# Altium project bldc-robot-main-board-2016.PrjPcb
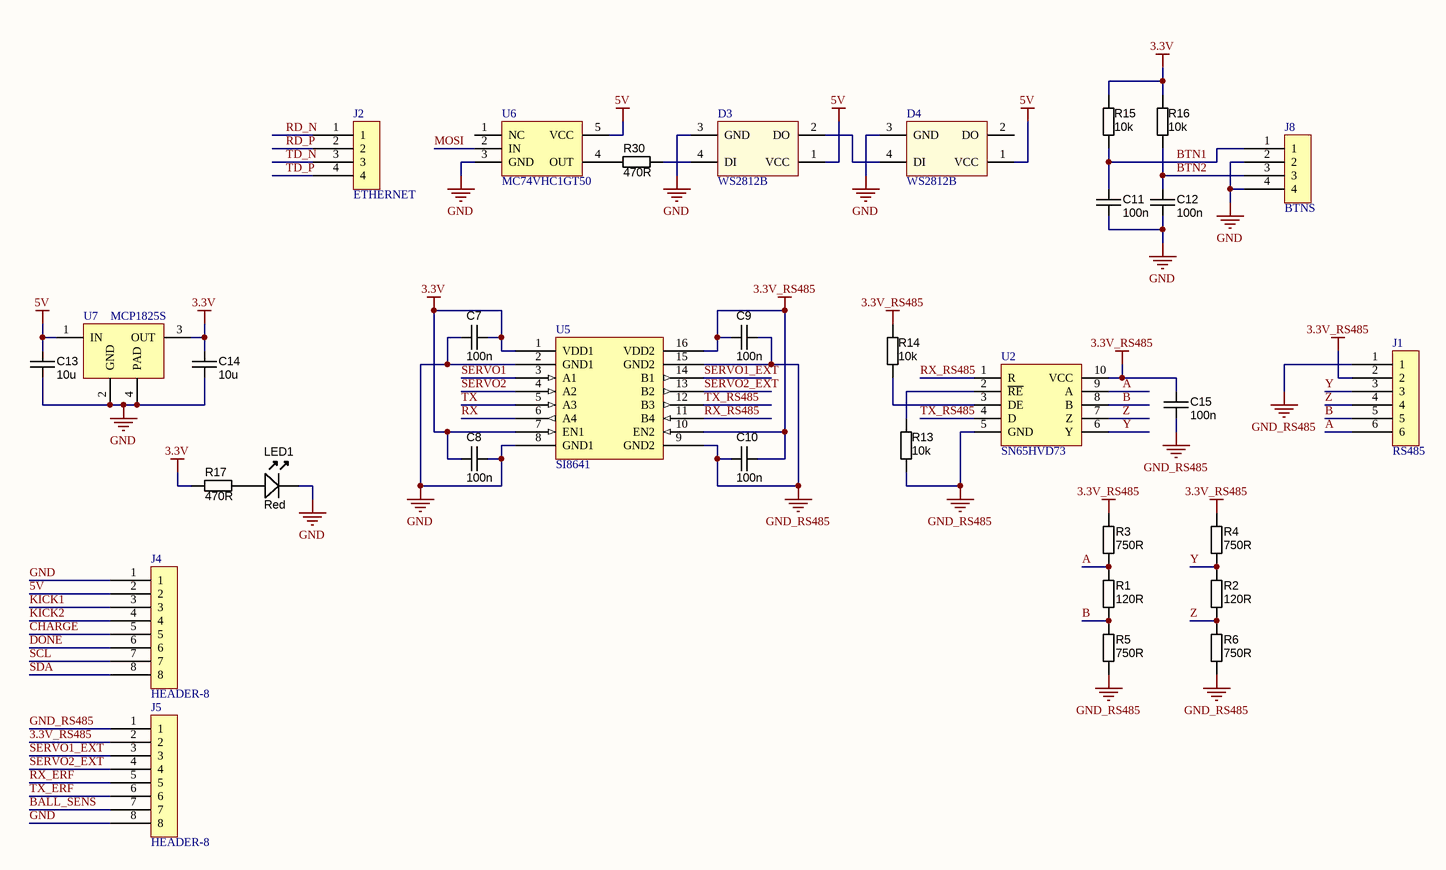
[diagram p0: bldc-robot-main-board-2016.SchDoc]
2 sheets, 72 parts. Net scope: global (net labels, ports and power ports of the same name join across sheets).
Board file: bldc-robot-main-board-2016.PcbDoc
Sheets:
  bldc-robot-main-board-2016.SchDoc
  bldc-robot-main-mbed.SchDoc

## Sheet bldc-robot-main-board-2016.SchDoc
size A3

### Parts
C7  100n  [CAPC1608X90N]
C8  100n  [CAPC1608X90N]
C9  100n  [CAPC1608X90N]
C10  100n  [CAPC1608X90N]
C11  100n  [CAPC1608X90N]
C12  100n  [CAPC1608X90N]
C13  10u  [CAPC3216X180N]
C14  10u  [CAPC3216X180N]
C15  100n  [CAPC1608X90N]
D3  WS2812B  [WS2812B]
D4  WS2812B  [WS2812B]
J1  RS485  [MICRO-MATCH-6]
J2  ETHERNET  [MICRO-MATCH-4]
J4  HEADER-8  [MICRO-MATCH-8]
J5  HEADER-8  [MICRO-MATCH-8]
J8  BTNS  [MICRO-MATCH-4]
LED1  Red  [LED-0603-RED]
R1  120R  [RESC1608X55N]
R2  120R  [RESC1608X55N]
R3  750R  [RESC1608X55N]
R4  750R  [RESC1608X55N]
R5  750R  [RESC1608X55N]
R6  750R  [RESC1608X55N]
R13  10k  [RESC1608X55N]
R14  10k  [RESC1608X55N]
R15  10k  [RESC1608X55N]
R16  10k  [RESC1608X55N]
R17  470R  [RESC1608X55N]
R30  470R  [RESC1608X55N]
U2  SN65HVD73  [SOP10]
U5  SI8641  [SOIC16]
U6  MC74VHC1GT50  [SC70-5]
U7  MCP1825S  [SOT230P700X180-4N]

### Nets
3.3V: C7.1 C8.2 C14.1 R15.2 R16.2 R17.2 U5.1(VDD1) U5.7(EN1) U7.3(OUT)
3.3V_RS485: C9.2 C10.1 C15.1 J1.2 J5.2 R3.1 R4.1 R14.2 U2.10(VCC) U5.10(EN2) U5.16(VDD2)
5V: C13.1 D3.1(VCC) D4.1(VCC) J4.2 U6.5(VCC) U7.1(IN)
GND: C7.2 C8.1 C11.2 C12.2 C13.2 C14.2 D3.3(GND) D4.3(GND) J4.1 J5.8 J8.2 J8.4 LED1.K U5.2(GND1) U5.8(GND1) U6.3(GND) U7.2(GND) U7.4(PAD)
GND_RS485: C9.1 C10.2 C15.2 J1.1 J5.1 R5.2 R6.2 R13.1 U2.5(GND) U5.9(GND2) U5.15(GND2)
A: J1.6 R1.1 R3.2 U2.9(A)
B: J1.5 R1.2 R5.1 U2.8(B)
BALL_SENS: J5.7
BTN1: C11.1 J8.1 R15.1
BTN2: C12.1 J8.3 R16.1
CHARGE: J4.5
DONE: J4.6
KICK1: J4.3
KICK2: J4.4
MOSI: U6.2(IN)
RD_N: J2.1
RD_P: J2.2
RX: U5.6(A4)
RX_ERF: J5.5
RX_RS485: U2.1(R) U5.11(B4)
SCL: J4.7
SDA: J4.8
SERVO1: U5.3(A1)
SERVO1_EXT: J5.3 U5.14(B1)
SERVO2: U5.4(A2)
SERVO2_EXT: J5.4 U5.13(B2)
TD_N: J2.3
TD_P: J2.4
TX: U5.5(A3)
TX_ERF: J5.6
TX_RS485: U2.4(D) U5.12(B3)
Y: J1.3 R2.1 R4.2 U2.6(Y)
Z: J1.4 R2.2 R6.1 U2.7(Z)
NetD3_2: D3.2(DO) D4.4(DI)
NetD3_4: D3.4(DI) R30.1
NetLED1_A: LED1.A R17.1
NetR13_2: R13.2 U2.2(~{RE})
NetR14_1: R14.1 U2.3(DE)
NetR30_2: R30.2 U6.4(OUT)

Not connected (* = marked no-connect by the designer): D4 2(DO); U6 1(NC)

### Library data of the parts
C7-C12 C15 = CAPC_100n_0603_X7R_50V_10%: Capacitor SMD Cer 100nF 10% 50V X7R 0603; Manufacturer 1: AVX Corporation; Manufacturer Part Number 1: 06035C104KAT2A; Ratings: 50V; X7R; Material: ceramic; SCDType: spec; Manufacturer 2: TDK Corporation; Manufacturer Part Number 2: C1608X7R1H104K; Package / Case: 0603 (1608 Metric); Tolerance: ±10%; Supplier 1: Digi-Key; Supplier Part Number 1: 478-5052-1-ND; ComponentLink1URL: http://www.avx.com/docs/Catalogs/cx7r.pdf; ComponentLink1Description: http://www.avx.com/docs/Catalogs/cx7r.pdf; Supplier 2: Digi-Key; Supplier Part Number 2: 445-1314-1-ND; ComponentLink2URL: http://product.tdk.com/capacitor/mlcc/en/documents/mlcc_commercial_general_en.pdf; ComponentLink2Description: http://product.tdk.com/capacitor/mlcc/en/documents/mlcc_commercial_general_en.pdf; Value: 100n
C13 C14 = CAPC_10u_1206_10V: Capacitor SMD Cer 10uF 10% 10V X5R 1206; Manufacturer 1: KEMET; Manufacturer Part Number 1: C1206C106K8PACTU; Ratings: 10V; X5R; Material: ceramic; Value: 10µ; SCDType: undef; Package / Case: 1206 (3216 metric); Tolerance: ±10%; Supplier 1: Digi-Key; Supplier Part Number 1: C1206C106K8PACTU-ND
J1 = HEADER-6
J2 J8 = HEADER-4
LED1 = LED_SMD_Red_0603_220mcd: LED 0603 SMD Hyper Red 630nm 220mcd 20mA; Manufacturer 1: Kingbright Company LLC; Manufacturer Part Number 1: APT1608SURCK; Material: AlGaInP on GaAs; Ratings: 220 mcd; 630 nm; Voltage - Forward (Vf) Typ: 1.95V; Voltage - Forward (Vf) @ 10mA: 1.9V; SCDType: source; Package / Case: 0603 (1608 metric); Supplier 1: Digi-Key; Supplier Part Number 1: 754-1123-1-ND; ComponentLink1URL: http://www.us.kingbright.com/images/catalog/SPEC/APT1608SURCK.pdf; ComponentLink1Description: http://www.us.kingbright.com/images/catalog/SPEC/APT1608SURCK.pdf
R1 R2 = RES_120R_0603_5%: Resistor SMD chip 120 Ohm 0.1W 5% 0603; Manufacturer 1: Vishay Dale; Manufacturer Part Number 1: CRCW0603120RJNEA; Ratings: 1/10 W; SCDType: spec; Package / Case: 0603 (1608 metric); Tolerance: ±5%; Material: Thick Film; Supplier 1: Digi-Key; Supplier Part Number 1: 541-120GCT-ND; ComponentLink1URL: http://www.vishay.com/doc?20035; ComponentLink1Description: http://www.vishay.com/doc?20035; Supplier 2: Digi-Key; Supplier Part Number 2: 311-120GRCT-ND; Manufacturer 2: Yageo; Manufacturer Part Number 2: RC0603JR-07120RL; ComponentLink2URL: http://www.yageo.com/documents/recent/PYu-RC0603_51_RoHS_L_4.pdf; ComponentLink2Description: http://www.yageo.com/documents/recent/PYu-RC0603_51_RoHS_L_4.pdf; Value: 120R
R3-R6 R13-R17 R30 = RES_120R_0603_5%: Resistor SMD chip 120 Ohm 0.1W 5% 0603; Manufacturer 1: Vishay Dale; Manufacturer Part Number 1: CRCW0603120RJNEA; Ratings: 1/10 W; SCDType: spec; Value: 120R; Package / Case: 0603 (1608 metric); Tolerance: ±5%; Material: Thick Film; Supplier 1: Digi-Key; Supplier Part Number 1: 541-120GCT-ND; ComponentLink1URL: http://www.vishay.com/doc?20035; ComponentLink1Description: http://www.vishay.com/doc?20035; Supplier 2: Digi-Key; Supplier Part Number 2: 311-120GRCT-ND; Manufacturer 2: Yageo; Manufacturer Part Number 2: RC0603JR-07120RL; ComponentLink2URL: http://www.yageo.com/documents/recent/PYu-RC0603_51_RoHS_L_4.pdf; ComponentLink2Description: http://www.yageo.com/documents/recent/PYu-RC0603_51_RoHS_L_4.pdf
U2 = SN65HVD3086E
U7 = MIC5239

## Sheet bldc-robot-main-mbed.SchDoc
size A3
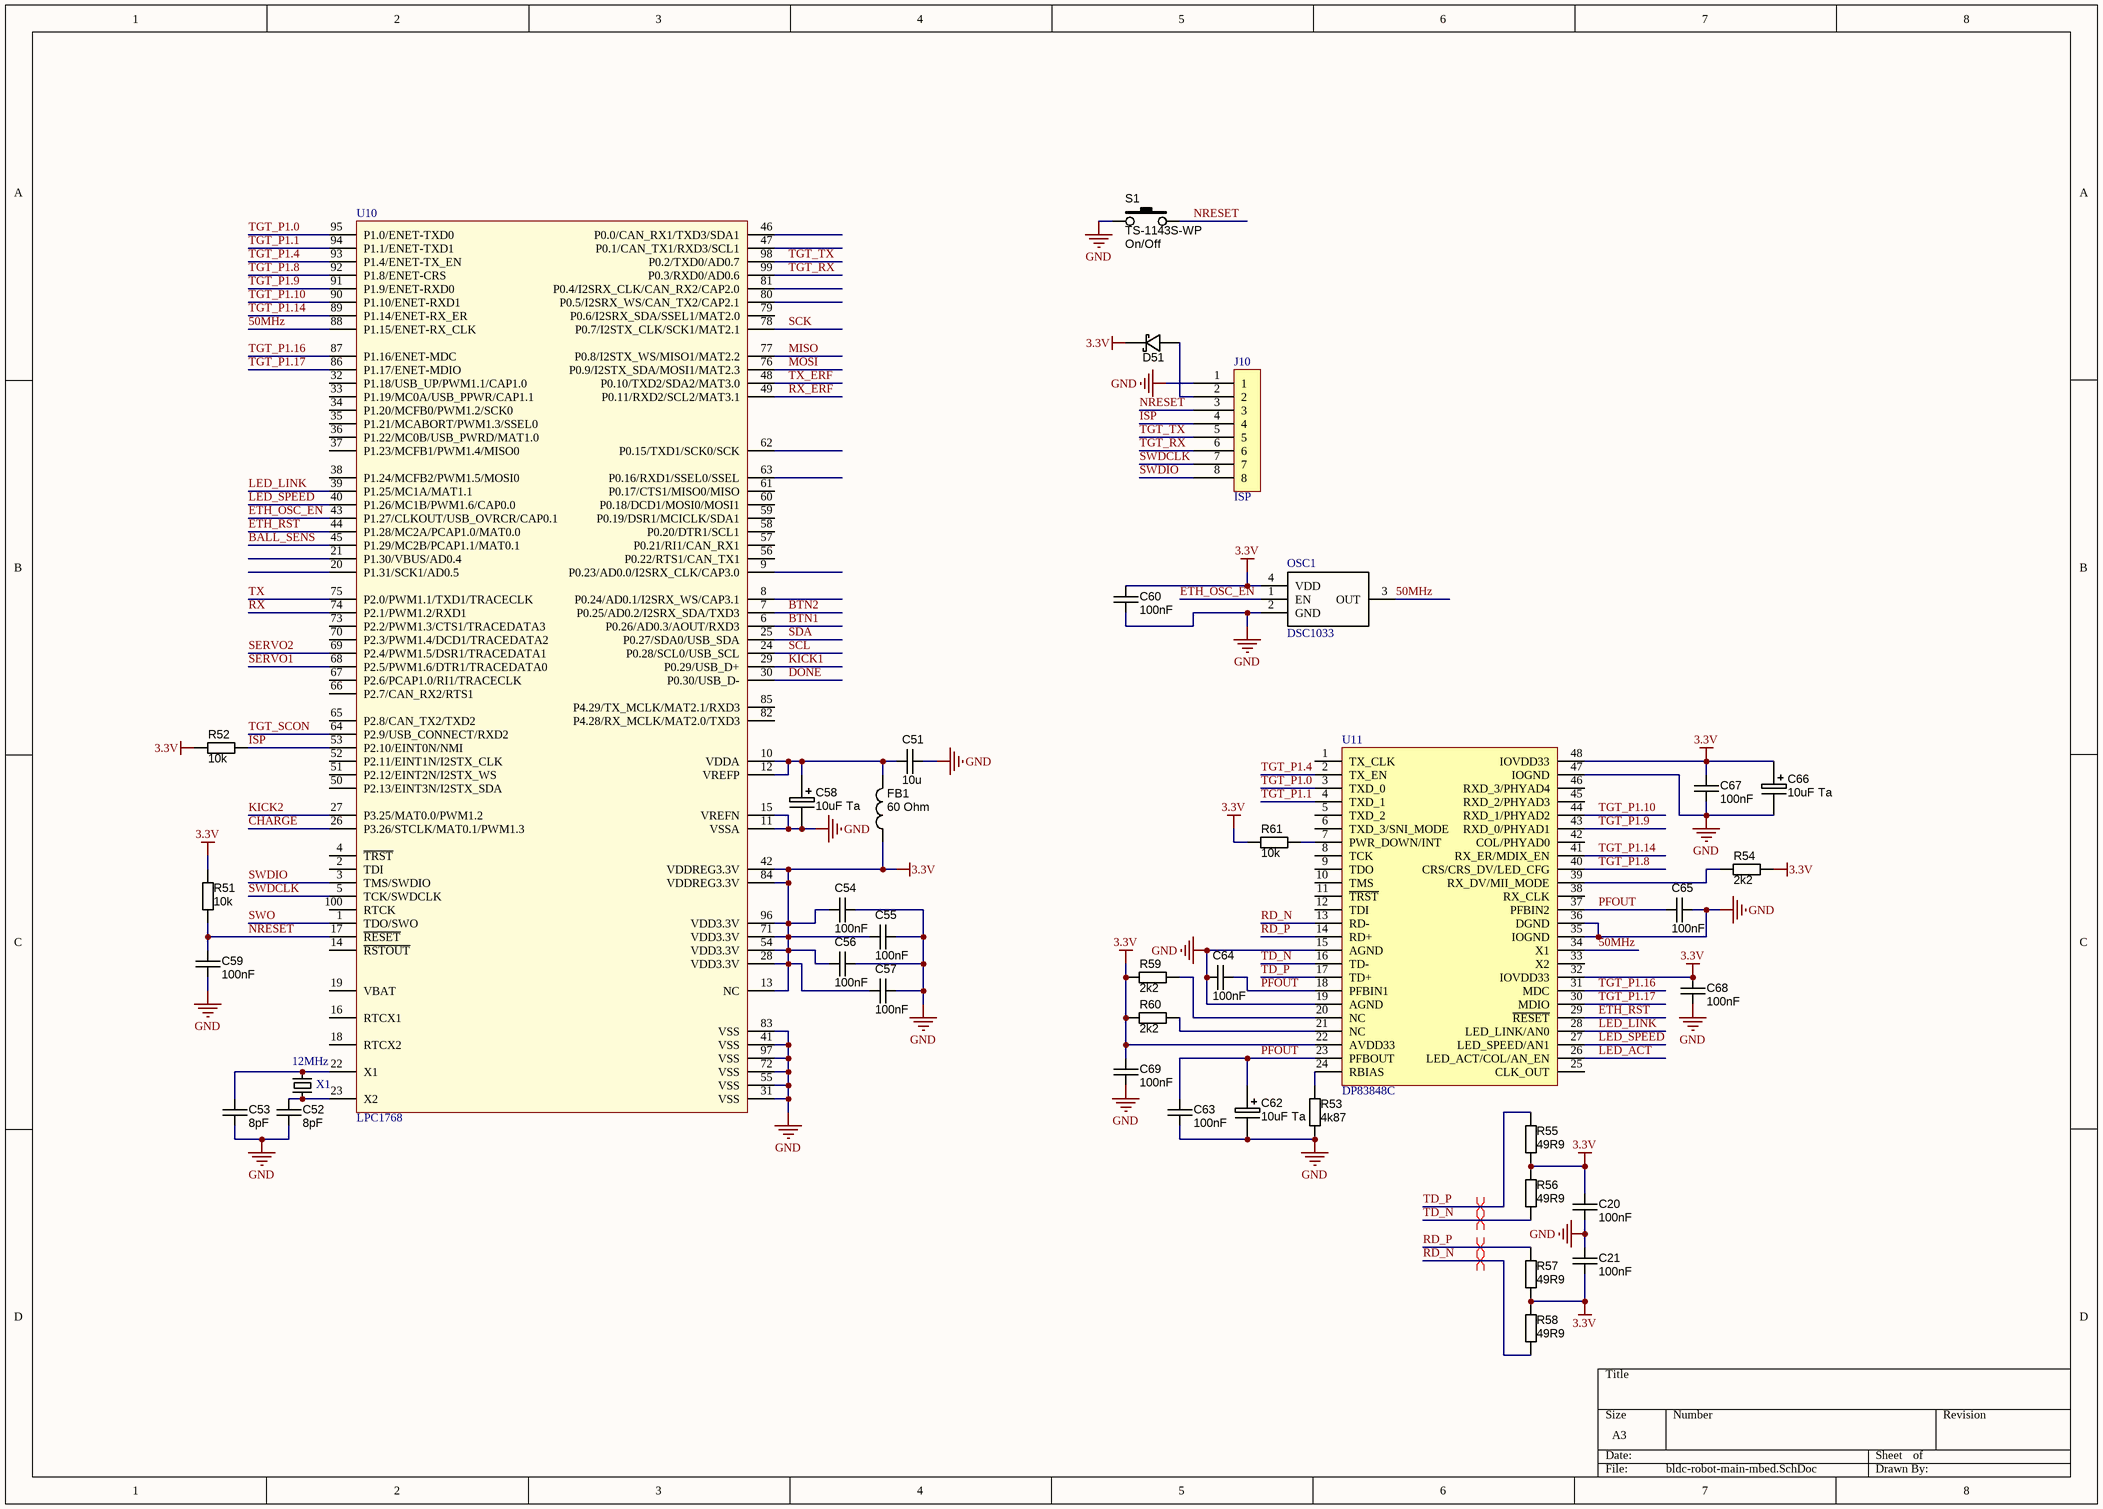
[diagram p1: bldc-robot-main-mbed.SchDoc]

### Parts
C20  100nF  [CAPC1608X90N]
C21  100nF  [CAPC1608X90N]
C51  10u  [CAPC2012X135N]
C52  8pF  [CAPC1608X90N]
C53  8pF  [CAPC1608X90N]
C54  100nF  [CAPC1608X90N]
C55  100nF  [CAPC1608X90N]
C56  100nF  [CAPC1608X90N]
C57  100nF  [CAPC1608X90N]
C58  10uF Ta  [CAPMP3528X210N]
C59  100nF  [CAPC1608X90N]
C60  100nF  [CAPC1608X90N]
C62  10uF Ta  [CAPMP3528X210N]
C63  100nF  [CAPC1608X90N]
C64  100nF  [CAPC1608X90N]
C65  100nF  [CAPC1608X90N]
C66  10uF Ta  [CAPMP3528X210N]
C67  100nF  [CAPC1608X90N]
C68  100nF  [CAPC1608X90N]
C69  100nF  [CAPC1608X90N]
D51  (no value)  [SOD323]
FB1  60 Ohm  [INDC1608N]
J10  ISP  [MICRO-MATCH-8]
OSC1  DSC1033  [DSC1033-3.2x2.5]
R51  10k  [RESC1608X55N]
R52  10k  [RESC1608X55N]
R53  4k87  [RESC1608X55N]
R54  2k2  [RESC1608X55N]
R55  49R9  [RESC1608X55N]
R56  49R9  [RESC1608X55N]
R57  49R9  [RESC1608X55N]
R58  49R9  [RESC1608X55N]
R59  2k2  [RESC1608X55N]
R60  2k2  [RESC1608X55N]
R61  10k  [RESC1608X55N]
S1  TS-1143S-WP  Function: On/Off  [TS-1143S]
U10  LPC1768  [LQFP100]
U11  DP83848C  [PQFP48]
X1  12MHz  [XTAL-3.2x2.5]

### Nets
3.3V: C20.2 C21.1 C54.1 C55.1 C56.1 C57.1 C60.2 C66.1 C67.2 C68.2 C69.2 D51.K FB1.1 OSC1.4(VDD) R51.1 R52.2 R54.1 R55.2 R56.1 R57.2 R58.1 R59.2 R60.2 R61.2 U10.13(NC) U10.28(VDD3.3V) U10.42(VDDREG3.3V) U10.54(VDD3.3V) U10.71(VDD3.3V) U10.84(VDDREG3.3V) U10.96(VDD3.3V) U11.22(AVDD33) U11.32(IOVDD33) U11.48(IOVDD33)
GND: C20.1 C21.2 C51.2 C52.2 C53.2 C54.2 C55.2 C56.2 C57.2 C58.2 C59.2 C60.1 C62.2 C63.1 C64.1 C65.2 C66.2 C67.1 C68.1 C69.1 J10.1 OSC1.2(GND) R53.2 S1.1 U10.11(VSSA) U10.15(VREFN) U10.31(VSS) U10.41(VSS) U10.55(VSS) U10.72(VSS) U10.83(VSS) U10.97(VSS) U11.15(AGND) U11.19(AGND) U11.35(IOGND) U11.36(DGND) U11.47(IOGND)
50MHz: OSC1.3(OUT) U10.88(P1.15/ENET-RX_CLK) U11.34(X1)
BALL_SENS: U10.45(P1.29/MC2B/PCAP1.1/MAT0.1)
BTN1: U10.6(P0.26/AD0.3/AOUT/RXD3)
BTN2: U10.7(P0.25/AD0.2/I2SRX_SDA/TXD3)
CHARGE: U10.26(P3.26/STCLK/MAT0.1/PWM1.3)
DONE: U10.30(P0.30/USB_D-)
ETH_OSC_EN: OSC1.1(EN) U10.43(P1.27/CLKOUT/USB_OVRCR/CAP0.1)
ETH_RST: U10.44(P1.28/MC2A/PCAP1.0/MAT0.0) U11.29(~{RESET})
ISP: J10.4 R52.1 U10.53(P2.10/EINT0N/NMI)
KICK1: U10.29(P0.29/USB_D+)
KICK2: U10.27(P3.25/MAT0.0/PWM1.2)
LED_ACT: U11.26(LED_ACT/COL/AN_EN)
LED_LINK: U10.39(P1.25/MC1A/MAT1.1) U11.28(LED_LINK/AN0)
LED_SPEED: U10.40(P1.26/MC1B/PWM1.6/CAP0.0) U11.27(LED_SPEED/AN1)
MISO: U10.77(P0.8/I2STX_WS/MISO1/MAT2.2)
MOSI: U10.76(P0.9/I2STX_SDA/MOSI1/MAT2.3)
NRESET: C59.1 J10.3 R51.2 S1.2 U10.17(~{RESET})
PFOUT: C62.1 C63.2 C64.2 C65.1 U11.18(PFBIN1) U11.23(PFBOUT) U11.37(PFBIN2)
RD_N: R58.2 U11.13(RD-)
RD_P: R57.1 U11.14(RD+)
RX: U10.74(P2.1/PWM1.2/RXD1)
RX_ERF: U10.49(P0.11/RXD2/SCL2/MAT3.1)
SCK: U10.78(P0.7/I2STX_CLK/SCK1/MAT2.1)
SCL: U10.24(P0.28/SCL0/USB_SCL)
SDA: U10.25(P0.27/SDA0/USB_SDA)
SERVO1: U10.68(P2.5/PWM1.6/DTR1/TRACEDATA0)
SERVO2: U10.69(P2.4/PWM1.5/DSR1/TRACEDATA1)
SWDCLK: J10.7 U10.5(TCK/SWDCLK)
SWDIO: J10.8 U10.3(TMS/SWDIO)
SWO: U10.1(TDO/SWO)
TD_N: R56.2 U11.16(TD-)
TD_P: R55.1 U11.17(TD+)
TGT_P1.0: U10.95(P1.0/ENET-TXD0) U11.3(TXD_0)
TGT_P1.1: U10.94(P1.1/ENET-TXD1) U11.4(TXD_1)
TGT_P1.4: U10.93(P1.4/ENET-TX_EN) U11.2(TX_EN)
TGT_P1.8: U10.92(P1.8/ENET-CRS) U11.40(CRS/CRS_DV/LED_CFG)
TGT_P1.9: U10.91(P1.9/ENET-RXD0) U11.43(RXD_0/PHYAD1)
TGT_P1.10: U10.90(P1.10/ENET-RXD1) U11.44(RXD_1/PHYAD2)
TGT_P1.14: U10.89(P1.14/ENET-RX_ER) U11.41(RX_ER/MDIX_EN)
TGT_P1.16: U10.87(P1.16/ENET-MDC) U11.31(MDC)
TGT_P1.17: U10.86(P1.17/ENET-MDIO) U11.30(MDIO)
TGT_RX: J10.6 U10.99(P0.3/RXD0/AD0.6)
TGT_SCON: U10.64(P2.9/USB_CONNECT/RXD2)
TGT_TX: J10.5 U10.98(P0.2/TXD0/AD0.7)
TX: U10.75(P2.0/PWM1.1/TXD1/TRACECLK)
TX_ERF: U10.48(P0.10/TXD2/SDA2/MAT3.0)
NetC51_1: C51.1 C58.1 FB1.2 U10.10(VDDA) U10.12(VREFP)
NetC52_1: C52.1 U10.23(X2) X1.1
NetC53_1: C53.1 U10.22(X1) X1.3
NetD51_A: D51.A J10.2
NetR53_1: R53.1 U11.24(RBIAS)
NetR54_2: R54.2 U11.39(RX_DV/MII_MODE)
NetR59_1: R59.1 U11.20(NC)
NetR60_1: R60.1 U11.21(NC)
NetR61_1: R61.1 U11.7(PWR_DOWN/INT)

Not connected (* = marked no-connect by the designer): U10 2(TDI) 4(~{TRST}) 8(P0.24/AD0.1/I2SRX_WS/CAP3.1) 9(P0.23/AD0.0/I2SRX_CLK/CAP3.0) 14(~{RSTOUT}) 16(RTCX1) 18(RTCX2) 19(VBAT) 20(P1.31/SCK1/AD0.5) 21(P1.30/VBUS/AD0.4) 32(P1.18/USB_UP/PWM1.1/CAP1.0) 33(P1.19/MC0A/USB_PPWR/CAP1.1) 34(P1.20/MCFB0/PWM1.2/SCK0) 35(P1.21/MCABORT/PWM1.3/SSEL0) 36(P1.22/MC0B/USB_PWRD/MAT1.0) 37(P1.23/MCFB1/PWM1.4/MISO0) 38(P1.24/MCFB2/PWM1.5/MOSI0) 46(P0.0/CAN_RX1/TXD3/SDA1) 47(P0.1/CAN_TX1/RXD3/SCL1) 50(P2.13/EINT3N/I2STX_SDA) 51(P2.12/EINT2N/I2STX_WS) 52(P2.11/EINT1N/I2STX_CLK) 56(P0.22/RTS1/CAN_TX1) 57(P0.21/RI1/CAN_RX1) 58(P0.20/DTR1/SCL1) 59(P0.19/DSR1/MCICLK/SDA1) 60(P0.18/DCD1/MOSI0/MOSI1) 61(P0.17/CTS1/MISO0/MISO) 62(P0.15/TXD1/SCK0/SCK) 63(P0.16/RXD1/SSEL0/SSEL) 65(P2.8/CAN_TX2/TXD2) 66(P2.7/CAN_RX2/RTS1) 67(P2.6/PCAP1.0/RI1/TRACECLK) 70(P2.3/PWM1.4/DCD1/TRACEDATA2) 73(P2.2/PWM1.3/CTS1/TRACEDATA3) 79(P0.6/I2SRX_SDA/SSEL1/MAT2.0) 80(P0.5/I2SRX_WS/CAN_TX2/CAP2.1) 81(P0.4/I2SRX_CLK/CAN_RX2/CAP2.0) 82(P4.28/RX_MCLK/MAT2.0/TXD3) 85(P4.29/TX_MCLK/MAT2.1/RXD3) 100(RTCK); U11 1(TX_CLK) 5(TXD_2) 6(TXD_3/SNI_MODE) 8(TCK) 9(TDO) 10(TMS) 11(~{TRST}) 12(TDI) 25(CLK_OUT) 33(X2) 38(RX_CLK) 42(COL/PHYAD0) 45(RXD_2/PHYAD3) 46(RXD_3/PHYAD4)

### Layout directives
differential pair: RD_N, RD_P, TD_N, TD_P

### Library data of the parts
C20 C21 C52-C57 C59 C60 C63-C65 C67-C69 = CAPC_18p_0603_100V: Capacitor SMD Cer 18pF 2% 100V NP0 0603; Manufacturer 1: AVX Corporation; Manufacturer Part Number 1: 06031A180GAT2A; Ratings: 100V; NP0; Value: 18p; SCDType: spec; Tolerance: ±2%; Operating Temperature: -55°C ~ 125°C; Package / Case: 0603 (1608 Metric); Supplier 1: Digi-Key; Supplier Part Number 1: 478-6025-1-ND; Size / Dimension: 0.063" L x 0.032" W (1.60mm x 0.81mm); Thickness (Max): 0.035" (0.90mm); ComponentLink1URL: http://www.avx.com/docs/Catalogs/ccog.pdf; ComponentLink1Description: http://www.avx.com/docs/Catalogs/ccog.pdf
C51 = CAPC_10u_0805_10V: Capacitor SMD Cer 10uF 10% 10V X5R 0805; Manufacturer 1: AVX Corporation; Manufacturer Part Number 1: 0805ZD106KAT2A; Ratings: 10V; X5R; Material: ceramic; Value: 10µ; SCDType: spec; Package / Case: 0805 (2012 metric); Tolerance: ±10%; Manufacturer 2: Kemet; Manufacturer Part Number 2: C0805C106K8PACTU; Supplier 1: Digi-Key; Supplier Part Number 1: 478-5167-1-ND; ComponentLink1URL: http://www.avx.com/docs/Catalogs/cx5r.pdf; ComponentLink1Description: http://www.avx.com/docs/Catalogs/cx5r.pdf; ComponentLink2URL: http://www.kemet.com/datasheets&C0805C106K8PACTU; ComponentLink2Description: http://www.kemet.com/datasheets&C0805C106K8PACTU; Supplier 2: Digi-Key; Supplier Part Number 2: 399-4925-1-ND
C58 C62 C66 = CAPT_47u_1210_6V3: Capacitor SMD Tantalum 47uF 20% 6.3V 1210; Manufacturer 1: AVX Corporation; Manufacturer Part Number 1: TCJB476M006R0070; Manufacturer Size Code: B; Voltage - Rated: 6V3; ESR (Equivalent Series Resistance): 70.0 mOhm; Type: Molded; Value: 47µ; SCDType: spec; Package / Case: 1210 (3528 Metric); Tolerance: ±20%; Material: Tantalum; Supplier 1: Digi-Key; Supplier Part Number 1: 478-3139-1-ND; Operating Temperature: -55°C ~ 125°C; Size / Dimension: 0.138" L x 0.110" W (3.50mm x 2.80mm); Height - Seated (Max): 0.083" (2.10mm); ComponentLink1URL: http://www.avx.com/docs/Catalogs/tcj.pdf; ComponentLink1Description: http://www.avx.com/docs/Catalogs/tcj.pdf; Ratings: 6.3V
D51 = DIODE_SCHOTTKY_SS0520: Diode Schottky SMD 20V 0.5A SOD123; Manufacturer 1: Fairchild Semiconductor; Manufacturer Part Number 1: MBR0520L; Material: Si; Ratings: 20V; 0.5A; SCDType: source; Manufacturer 4: DC Components Co; Package / Case: SOD-123; Supplier 1: Digi-Key; Supplier Part Number 1: MBR0520LCT-ND; Supplier 2: Digi-Key; Supplier Part Number 2: MBR0520LT1GOSCT-ND; Manufacturer 2: ON Semiconductor; Manufacturer Part Number 2: MBR0520LT1G; ComponentLink1URL: http://www.fairchildsemi.com/ds/MB/MBR0520L.pdf; ComponentLink1Description: http://www.fairchildsemi.com/ds/MB/MBR0520L.pdf; ComponentLink2URL: http://www.onsemi.com/pub_link/Collateral/MBR0520LT1-D.PDF; ComponentLink2Description: http://www.onsemi.com/pub_link/Collateral/MBR0520LT1-D.PDF; Supplier 3: Digi-Key; Supplier Part Number 3: B0520LW-FDICT-ND; ComponentLink3URL: http://www.diodes.com/datasheets/ds30051.pdf; ComponentLink3Description: http://www.diodes.com/datasheets/ds30051.pdf; Manufacturer 3: Diodes Inc; Manufacturer Part Number 3: B0520LW-7-F; Manufacturer Part Number 4: SS0520
FB1 = FERRITE_120R-100MHz_0603: Ferrite bead 120 Ohm at 100 MHz 2A 0603 SMD; Manufacturer 1: Murata Electronics North America; Manufacturer Part Number 1: BLM18PG121SN1D; Current: 900mA; DC Resistance (DCR): 172.9 mOhm Max; Frequency - Self Resonant: 23MHz; Frequency - Test: 100kHz; Impedance @ Frequency: 120 Ohm @ 100MHz; Filter Type: Differential Mode - Single; Number of Lines: 1; Ratings: 2 A; 50 mO DC; Value: 120R @ 100 MHz; SCDType: source; Current - Saturation: 900mA; Current - Temperature Rise: 900mA; Applications: Power Supplies; Package / Case: 1210 (3225 Metric); Operating Temperature: -40°C ~ 105°C; ComponentLink1URL: http://www.yuden.co.jp/ut/product/pdf/wound02_e.pdf; ComponentLink1Description: http://www.yuden.co.jp/ut/product/pdf/wound02_e.pdf; Supplier 1: Digi-Key; Supplier Part Number 1: 490-1037-1-ND; Current Rating: 2A; Mounting Type: Surface Mount; Height (Max): 0.037" (0.95mm); Size / Dimension: 0.063" L x 0.031" W (1.60mm x 0.80mm); ComponentLink2URL: http://search.murata.co.jp/Ceramy/image/img/PDF/ENG/L0110S0100BLM18P.pdf; ComponentLink2Description: http://search.murata.co.jp/Ceramy/image/img/PDF/ENG/L0110S0100BLM18P.pdf
J10 = HEADER-8
R51-R61 = RES_10K_0603_5%: Resistor SMD chip 10k Ohm 0.1W 5% 0603; Manufacturer 1: Yageo; Manufacturer Part Number 1: RC0603JR-0710KL; Ratings: 1/10 W; SCDType: spec; Package / Case: 0603 (1608 metric); Tolerance: ±5%; Material: Thick Film; Supplier 1: Digi-Key; Supplier Part Number 1: 311-10KGRCT-ND; Supplier 2: Digi-Key; Supplier Part Number 2: 541-10KGCT-ND; Manufacturer 2: Vishay Dale; Manufacturer Part Number 2: CRCW060310K0JNEA; ComponentLink2URL: http://www.vishay.com/doc?20035; ComponentLink2Description: http://www.vishay.com/doc?20035; ComponentLink1URL: http://www.yageo.com/documents/recent/PYu-RC0603_51_RoHS_L_4.pdf; ComponentLink1Description: http://www.yageo.com/documents/recent/PYu-RC0603_51_RoHS_L_4.pdf; Value: 10K
S1 = SW_SMD_PB_4.3mm: Switch SMD Tact 4.3mm Stem; Manufacturer 1: Bond-Tact; Manufacturer Part Number 1: TS-1143S-WP-200; SCDType: spec; Package / Case: 6.5x6.5mm; 4.3mm stem
X1 = XTAL-3.2X2.5

## Nets that join several sheets
3.3V: bldc-robot-main-board-2016 (9 pins), bldc-robot-main-mbed (34 pins)
GND: bldc-robot-main-board-2016 (18 pins), bldc-robot-main-mbed (37 pins)
BALL_SENS: bldc-robot-main-board-2016 (J5.7), bldc-robot-main-mbed (U10.45)
BTN1: bldc-robot-main-board-2016 (C11.1 J8.1 R15.1), bldc-robot-main-mbed (U10.6)
BTN2: bldc-robot-main-board-2016 (C12.1 J8.3 R16.1), bldc-robot-main-mbed (U10.7)
CHARGE: bldc-robot-main-board-2016 (J4.5), bldc-robot-main-mbed (U10.26)
DONE: bldc-robot-main-board-2016 (J4.6), bldc-robot-main-mbed (U10.30)
KICK1: bldc-robot-main-board-2016 (J4.3), bldc-robot-main-mbed (U10.29)
KICK2: bldc-robot-main-board-2016 (J4.4), bldc-robot-main-mbed (U10.27)
MOSI: bldc-robot-main-board-2016 (U6.2), bldc-robot-main-mbed (U10.76)
RD_N: bldc-robot-main-board-2016 (J2.1), bldc-robot-main-mbed (R58.2 U11.13)
RD_P: bldc-robot-main-board-2016 (J2.2), bldc-robot-main-mbed (R57.1 U11.14)
RX: bldc-robot-main-board-2016 (U5.6), bldc-robot-main-mbed (U10.74)
RX_ERF: bldc-robot-main-board-2016 (J5.5), bldc-robot-main-mbed (U10.49)
SCL: bldc-robot-main-board-2016 (J4.7), bldc-robot-main-mbed (U10.24)
SDA: bldc-robot-main-board-2016 (J4.8), bldc-robot-main-mbed (U10.25)
SERVO1: bldc-robot-main-board-2016 (U5.3), bldc-robot-main-mbed (U10.68)
SERVO2: bldc-robot-main-board-2016 (U5.4), bldc-robot-main-mbed (U10.69)
TD_N: bldc-robot-main-board-2016 (J2.3), bldc-robot-main-mbed (R56.2 U11.16)
TD_P: bldc-robot-main-board-2016 (J2.4), bldc-robot-main-mbed (R55.1 U11.17)
TX: bldc-robot-main-board-2016 (U5.5), bldc-robot-main-mbed (U10.75)
TX_ERF: bldc-robot-main-board-2016 (J5.6), bldc-robot-main-mbed (U10.48)